# EAGLE design Atto_LED_Coaster_RevB (EAGLE 9.5.2)
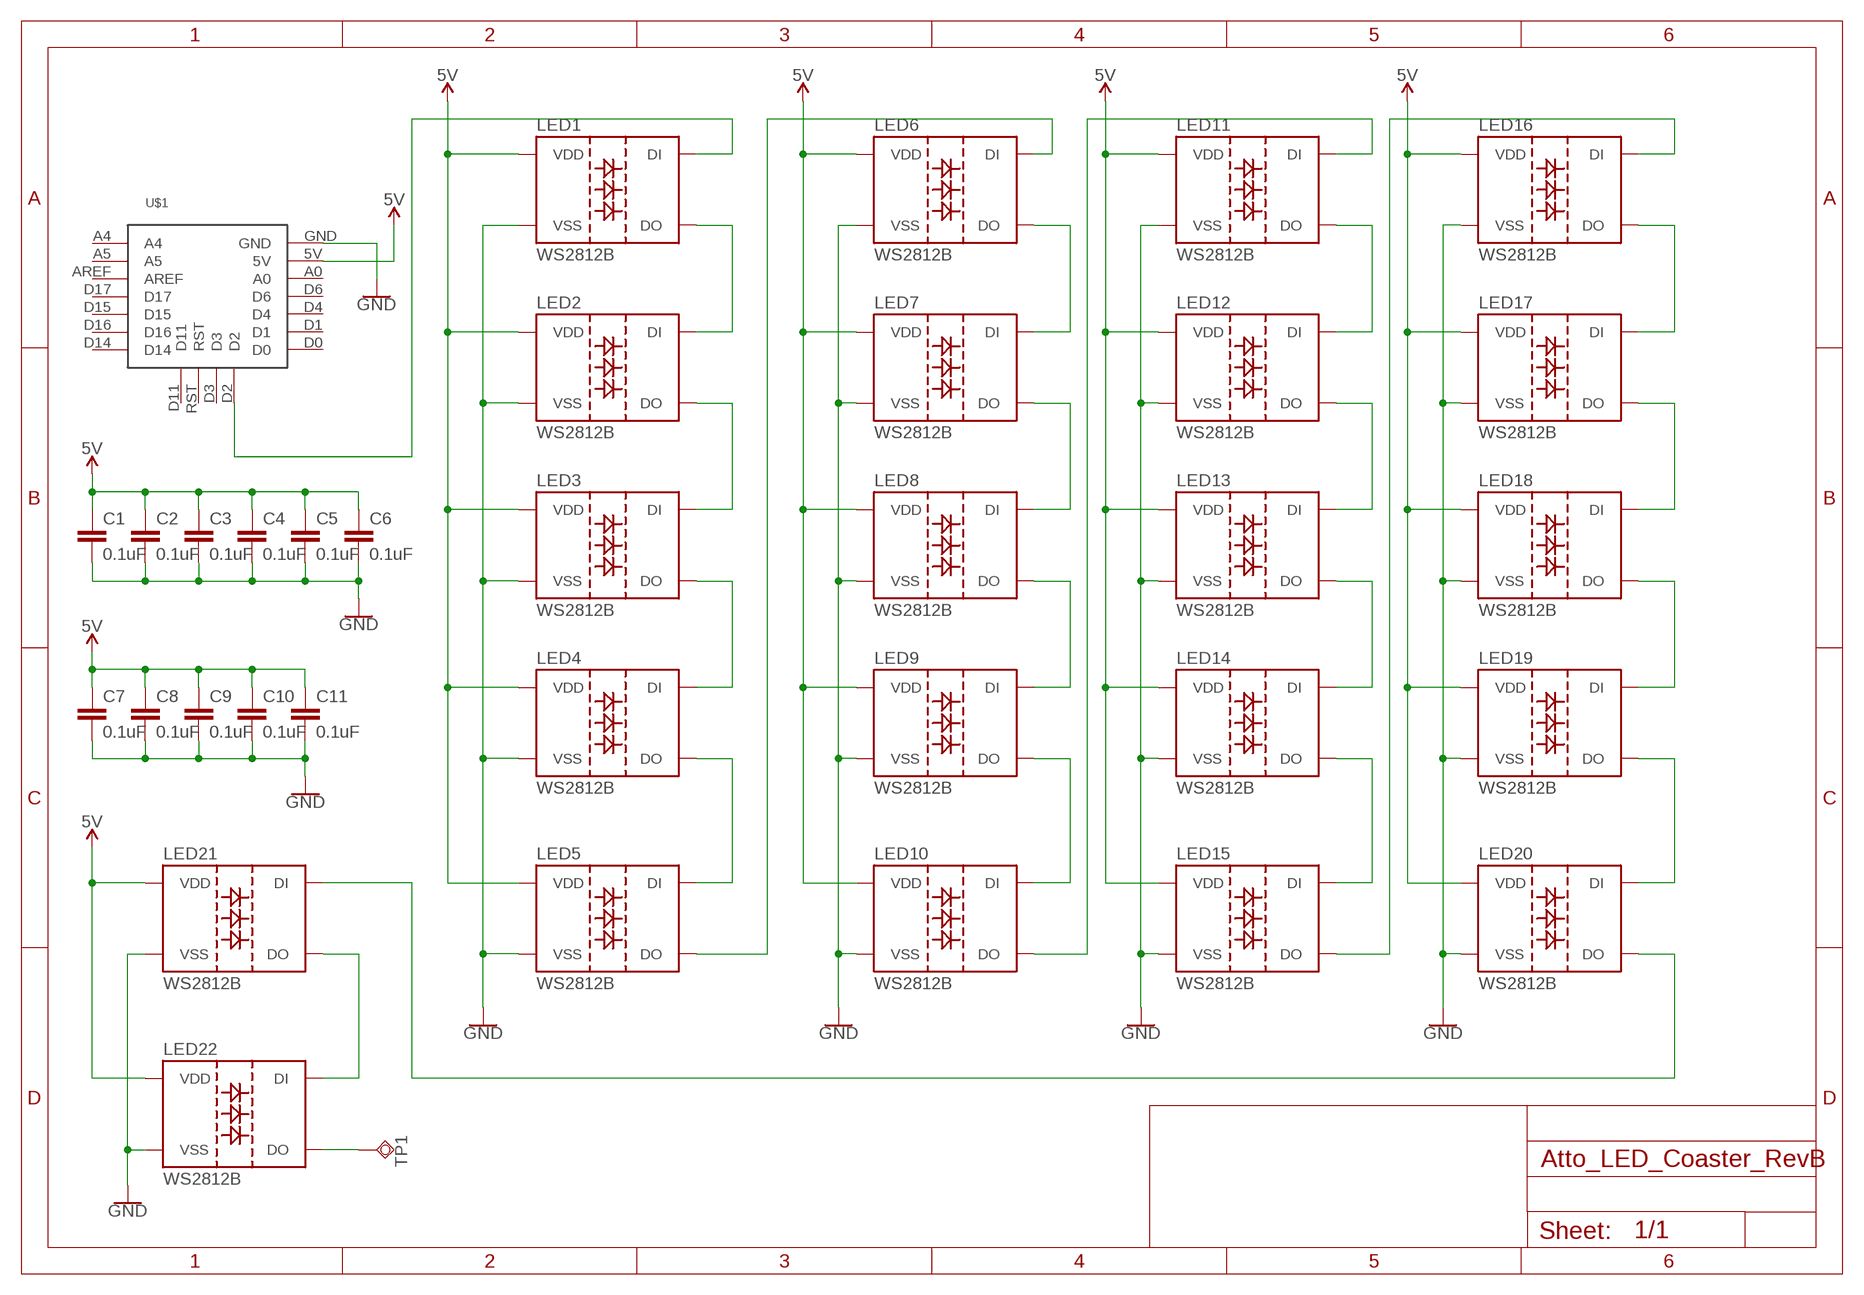
[diagram p0: schematic, sheet 1]

## Parts
C1  0.1uF  C-EUC0805  [C0805]
C2  0.1uF  C-EUC0805  [C0805]
C3  0.1uF  C-EUC0805  [C0805]
C4  0.1uF  C-EUC0805  [C0805]
C5  0.1uF  C-EUC0805  [C0805]
C6  0.1uF  C-EUC0805  [C0805]
C7  0.1uF  C-EUC0805  [C0805]
C8  0.1uF  C-EUC0805  [C0805]
C9  0.1uF  C-EUC0805  [C0805]
C10  0.1uF  C-EUC0805  [C0805]
C11  0.1uF  C-EUC0805  [C0805]
LED1  WS2812B  [WS2812B]
LED2  WS2812B  [WS2812B]
LED3  WS2812B  [WS2812B]
LED4  WS2812B  [WS2812B]
LED5  WS2812B  [WS2812B]
LED6  WS2812B  [WS2812B]
LED7  WS2812B  [WS2812B]
LED8  WS2812B  [WS2812B]
LED9  WS2812B  [WS2812B]
LED10  WS2812B  [WS2812B]
LED11  WS2812B  [WS2812B]
LED12  WS2812B  [WS2812B]
LED13  WS2812B  [WS2812B]
LED14  WS2812B  [WS2812B]
LED15  WS2812B  [WS2812B]
LED16  WS2812B  [WS2812B]
LED17  WS2812B  [WS2812B]
LED18  WS2812B  [WS2812B]
LED19  WS2812B  [WS2812B]
LED20  WS2812B  [WS2812B]
LED21  WS2812B  [WS2812B]
LED22  WS2812B  [WS2812B]
TP1  TPSQTP20R  [TP20R]
U$1  PIKSEY_ATTO  [PIKSEY_ATTO]

## Nets
5V: C1.1 C2.1 C3.1 C4.1 C5.1 C6.1 C7.1 C8.1 C9.1 C10.1 C11.1 LED1.3(VDD) LED2.3(VDD) LED3.3(VDD) LED4.3(VDD) LED5.3(VDD) LED6.3(VDD) LED7.3(VDD) LED8.3(VDD) LED9.3(VDD) LED10.3(VDD) LED11.3(VDD) LED12.3(VDD) LED13.3(VDD) LED14.3(VDD) LED15.3(VDD) LED16.3(VDD) LED17.3(VDD) LED18.3(VDD) LED19.3(VDD) LED20.3(VDD) LED21.3(VDD) LED22.3(VDD) U$1.5V
GND: C1.2 C2.2 C3.2 C4.2 C5.2 C6.2 C7.2 C8.2 C9.2 C10.2 C11.2 LED1.1(VSS) LED2.1(VSS) LED3.1(VSS) LED4.1(VSS) LED5.1(VSS) LED6.1(VSS) LED7.1(VSS) LED8.1(VSS) LED9.1(VSS) LED10.1(VSS) LED11.1(VSS) LED12.1(VSS) LED13.1(VSS) LED14.1(VSS) LED15.1(VSS) LED16.1(VSS) LED17.1(VSS) LED18.1(VSS) LED19.1(VSS) LED20.1(VSS) LED21.1(VSS) LED22.1(VSS) U$1.GND
N$1: LED1.2(DO) LED2.4(DI)
N$2: LED2.2(DO) LED3.4(DI)
N$3: LED3.2(DO) LED4.4(DI)
N$4: LED4.2(DO) LED5.4(DI)
N$5: LED6.2(DO) LED7.4(DI)
N$6: LED7.2(DO) LED8.4(DI)
N$7: LED8.2(DO) LED9.4(DI)
N$8: LED9.2(DO) LED10.4(DI)
N$9: LED11.2(DO) LED12.4(DI)
N$10: LED12.2(DO) LED13.4(DI)
N$11: LED13.2(DO) LED14.4(DI)
N$12: LED14.2(DO) LED15.4(DI)
N$13: LED16.2(DO) LED17.4(DI)
N$14: LED17.2(DO) LED18.4(DI)
N$15: LED18.2(DO) LED19.4(DI)
N$16: LED19.2(DO) LED20.4(DI)
N$17: LED22.2(DO) TP1.TP
N$18: LED15.2(DO) LED16.4(DI)
N$19: LED10.2(DO) LED11.4(DI)
N$20: LED5.2(DO) LED6.4(DI)
N$21: LED1.4(DI) U$1.D2
N$22: LED21.2(DO) LED22.4(DI)
N$23: LED20.2(DO) LED21.4(DI)
Unconnected: U$1.A0 U$1.A4 U$1.A5 U$1.AREF U$1.D0 U$1.D1 U$1.D3 U$1.D4 U$1.D6 U$1.D11 U$1.D14 U$1.D15 U$1.D16 U$1.D17 U$1.RST

## Library data of the parts
C1-C11 = rcl:C-EU: CAPACITOR, European symbol; SPICEPREFIX: C
LED1-LED10 LED12-LED22 = WS2812B-E:WS2812B
LED11 = WS2812B-E:WS2812B; SPICEPREFIX: E
TP1 = testpad:TPSQ: Test pad
U$1 = Frenoy_Custom:PIKSEY_ATTO

## Board
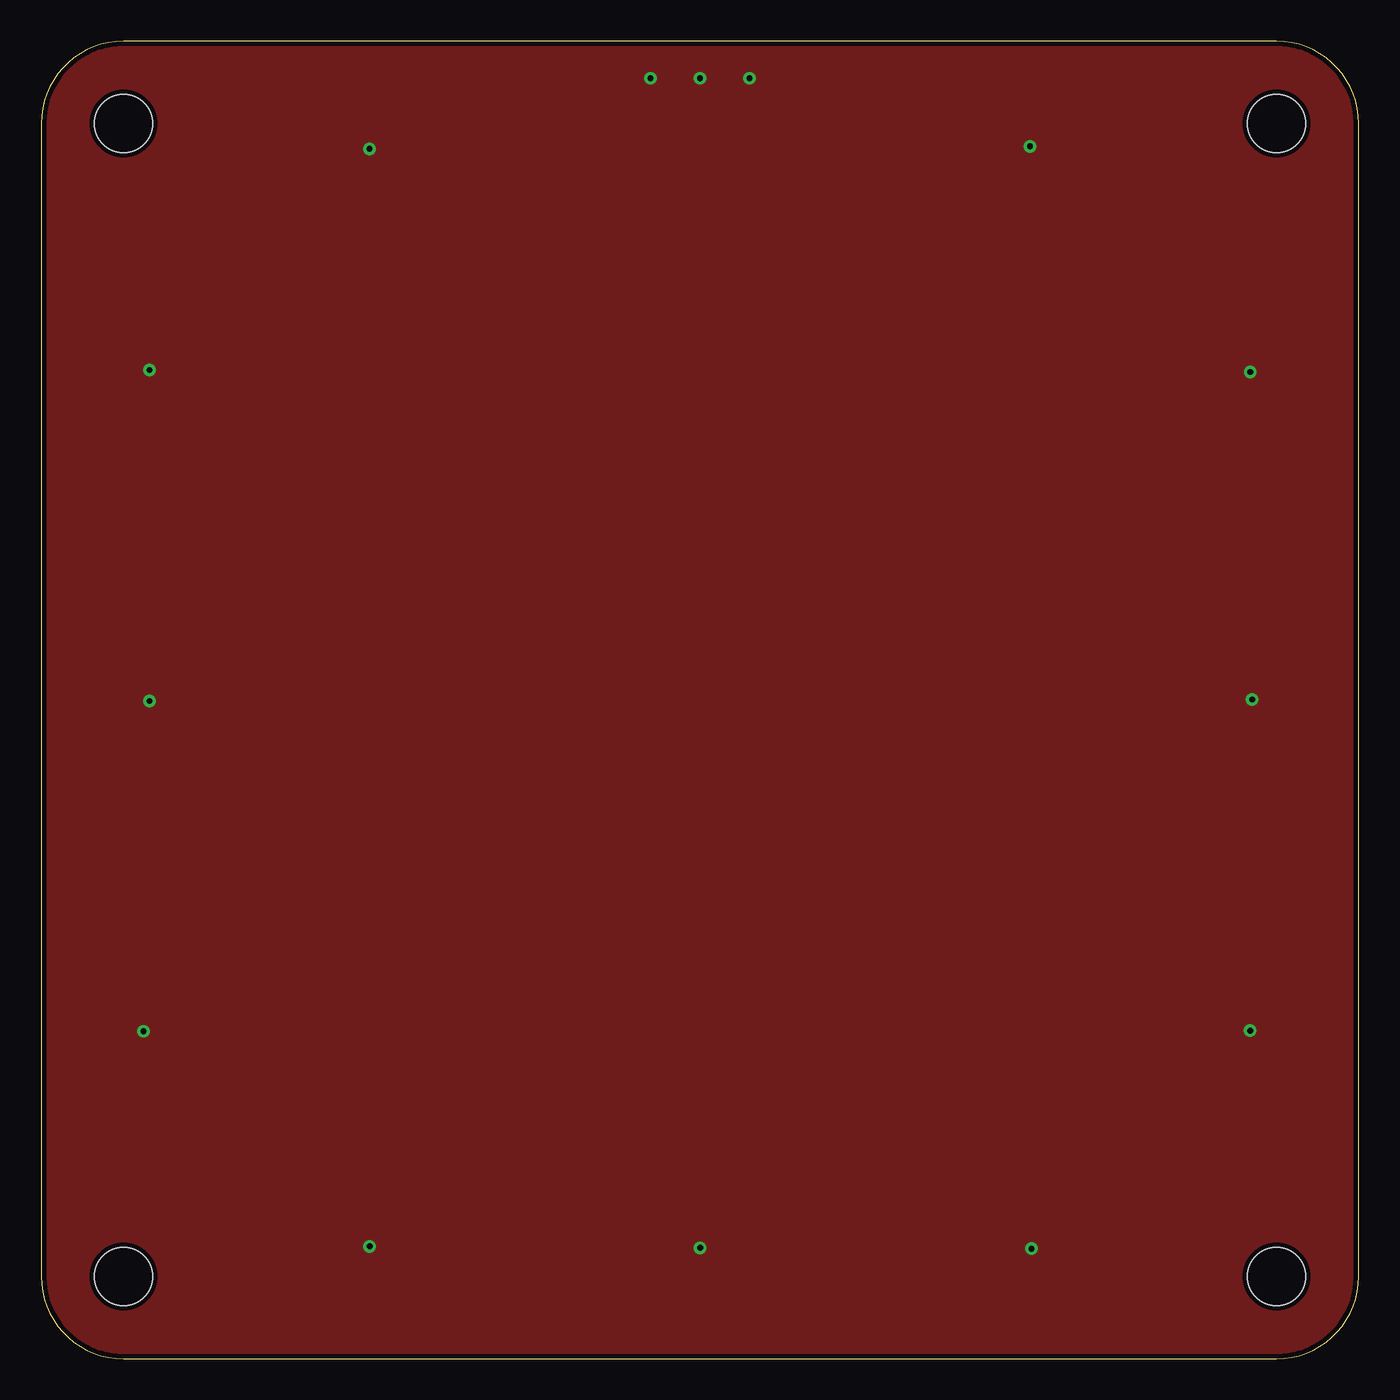
[diagram p1: board, top side]
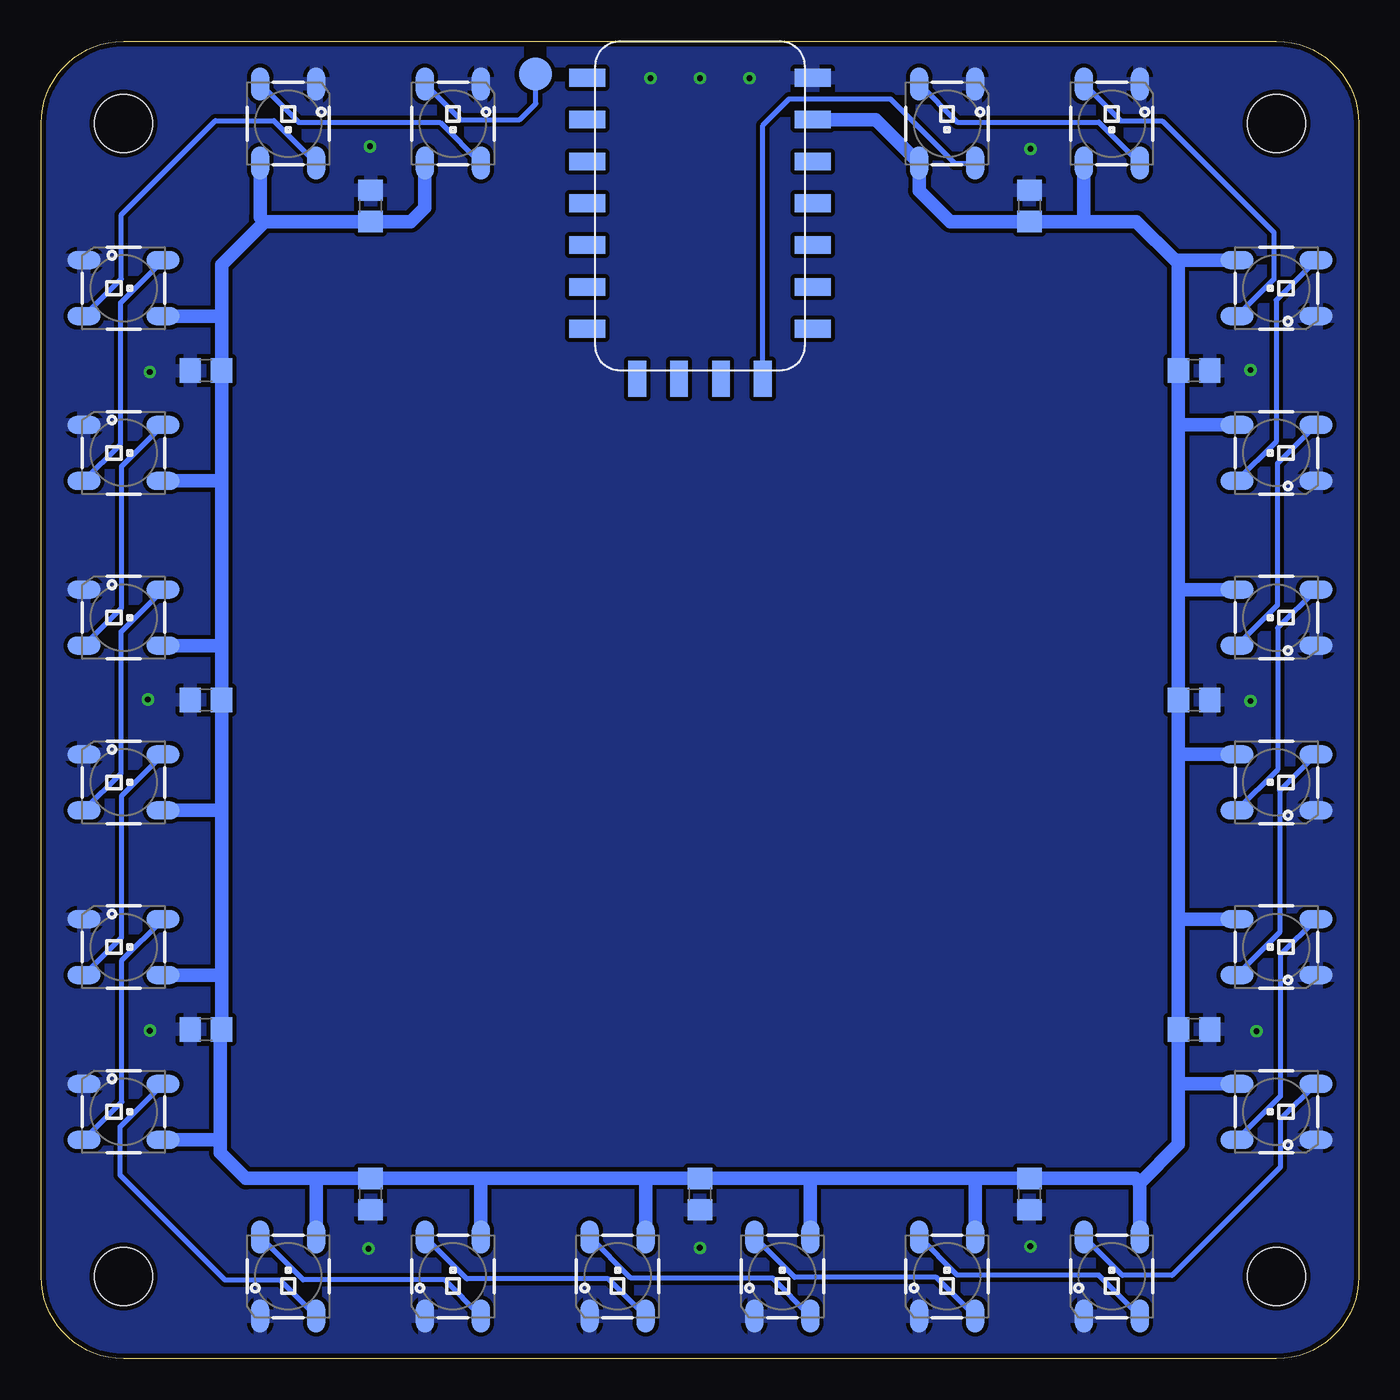
[diagram p2: board, bottom side, seen from below]

Size 80 x 80 mm. Coordinates in mm from the lower left corner, seen from the top.
Outline: 75,80 5,80 arc90 0,75 0,5 arc90 5,0 75,0 arc90 80,5 80,75 arc90 75,80
Copper layers (1*16): Top 0.035mm / dielectric 1.5mm / Bottom 0.035mm
Design rules "JLPCB_2L_Recommended_Use_this": minimum track width 8mil, minimum drill 0.3mm, track to track 8mil, track to pad 8mil, pad to pad 8mil, via to via 8mil, smd to smd 8mil, copper to edge 12mil, drill to drill 6mil, minimum pad ring 10mil, minimum via ring 8mil, stop-mask expansion 4mil, vias tented up to drill 20mil, thermal gap 10mil
Holes 3.5 mm at 5,75 75,75 75,5 5,5

### Footprints (pad centres in the part's own frame; a part is rotated, then mirrored left to right if it is on the bottom)
C0805 = smd 1.3 x 1.5: 1 -0.95,0; 2 0.95,0
WS2812B = smd 2 x 1.1: 1 -2.4,1.7; 2 -2.4,-1.7; 3 2.4,-1.7; 4 2.4,1.7
TP20R = smd 2 x 2: TP 0,0
PIKSEY_ATTO = smd 2.184 x 1.067: 5V 6.858,15.24; A0 6.858,12.7; A4 -6.858,15.24; A5 -6.858,17.78; AREF -6.858,12.7; D0 6.858,2.54; D1 6.858,5.08; D4 6.858,7.62; D6 6.858,10.16; D14 -6.858,2.54; D15 -6.858,7.62; D16 -6.858,5.08; D17 -6.858,10.16; GND 6.858,17.78 | smd 1.067 x 2.184: D2 3.81,-0.508; D3 1.27,-0.508; D11 -3.81,-0.508; RST -1.27,-0.508

### Placement (x,y rotation side)
C1  20,70 90 bottom
C2  10,60 0 bottom
C3  10,40 0 bottom
C4  10,20 0 bottom
C5  20,10 270 bottom
C6  40,10 270 bottom
C7  60,10 270 bottom
C8  70,20 180 bottom
C9  70,40 180 bottom
C10  70,60 180 bottom
C11  60,70 90 bottom
LED1  25,75 270 bottom
LED2  15,75 270 bottom
LED3  5,65 180 bottom
LED4  5,55 180 bottom
LED5  5,45 180 bottom
LED6  5,35 180 bottom
LED7  5,25 180 bottom
LED8  5,15 180 bottom
LED9  15,5 90 bottom
LED10  25,5 90 bottom
LED11  35,5 90 bottom
LED12  45,5 90 bottom
LED13  55,5 90 bottom
LED14  65,5 90 bottom
LED15  75,15 0 bottom
LED16  75,25 0 bottom
LED17  75,35 0 bottom
LED18  75,45 0 bottom
LED19  75,55 0 bottom
LED20  75,65 0 bottom
LED21  65,75 270 bottom
LED22  55,75 270 bottom
TP1  50,78 0 bottom
U$1  40,60 0 bottom

### Tracks (layer width: path | path; a pad name or v marks a point on that pad's centre or on a via)
5V
  Bottom 0.813: U$1.5V 29.34,75.24 LED1.3 26.7,70.93 24.82,69.05 C1.1 16.62,69.05 | 16.68,72.58 LED2.3 16.7,69.12 16.62,69.05 | LED3.3 11.15,66.7 | 16.62,69.05 13.5,69.05 11.15,66.7 | 23.38,10.95 C5.1 13.58,10.95 13.3,10.67 | 23.38,10.95 33.26,10.95 | 33.26,10.95 C6.1 43.39,10.95 | 43.39,10.95 53.42,10.95 | 53.42,10.95 C7.1 63.32,10.95 | LED9.3 13.3,10.67 | LED10.3 23.3,10.87 23.38,10.95 | LED11.3 33.3,10.91 33.26,10.95 | LED12.3 43.3,10.86 43.39,10.95 | LED13.3 53.3,10.83 53.42,10.95 | 63.32,10.95 67.58,10.95 69.13,12.5 69.13,13.27 | 69.13,13.27 69.13,19.92 C8.1 69.05,23.38 | 69.05,23.38 69.05,33.25 | 69.05,33.25 C9.1 69.05,43.35 | 69.05,43.35 69.05,53.29 | 69.05,53.29 C10.1 69.05,63.27 | 69.05,63.27 69.05,66.43 66.43,69.05 | 66.43,69.05 C11.1 57.55,69.05 56.7,69.9 LED22.3 | LED21.3 66.7,69.32 66.43,69.05 | 72.49,63.19 LED20.3 69.08,63.3 69.05,63.27 | LED19.3 69.06,53.3 69.05,53.29 | LED18.3 69.1,43.3 69.05,43.35 | LED17.3 69.1,33.3 69.05,33.25 | LED16.3 69.13,23.3 69.05,23.38 | LED15.3 69.17,13.3 69.13,13.27 | LED14.3 63.3,10.93 63.32,10.95 | 11.15,60.2 C2.1 | C2.1 10.95,56.66 | 10.95,56.66 10.95,46.59 | 10.95,46.59 C3.1 10.95,36.64 | 10.95,36.64 10.95,26.63 | 10.95,26.63 C4.1 10.95,16.56 | 10.95,16.56 10.95,13.02 13.3,10.67 | C2.1 10.95,66.5 11.15,66.7 | LED4.3 10.9,56.7 10.95,56.66 | LED5.3 10.84,46.7 10.95,46.59 | LED6.3 10.89,36.7 10.95,36.64 | LED7.3 10.88,26.7 10.95,26.63 | LED8.3 10.81,16.7 10.95,16.56
GND  (via drill 0.35)
  other vias: 37,77.75 40,77.75 43,77.75 19.93,73.46 6.58,60.03 6.58,39.94 6.22,19.89 19.94,6.83 40.01,6.74 60.12,6.69 73.4,19.92 73.52,40.03 73.41,59.92 60.03,73.61
  pour Bottom (isolate 0.254): -0.77,80.45 80.37,80.45 80.37,-0.78 -0.8,-0.78 -0.8,80.45
  pour Top (isolate 0.254): -0.33,80.36 80.82,80.36 80.82,-0.87 -0.35,-0.87 -0.35,80.36
N$1
  Bottom 0.305: LED1.2 24.39,75.08 15.79,75.08 LED2.4
N$2
  Bottom 0.305: LED2.2 14.47,75.17 11.94,75.17 5.16,68.39 5.16,65.54 LED3.4
N$3
  Bottom 0.305: LED3.2 5.02,64.28 5.02,55.68 LED4.4
N$4
  Bottom 0.305: LED4.2 4.95,54.35 4.95,45.75 LED5.4
N$5
  Bottom 0.305: LED6.2 4.81,34.49 4.81,25.89 LED7.4
N$6
  Bottom 0.305: LED7.2 4.76,24.54 4.76,15.94 LED8.4
N$7
  Bottom 0.305: LED8.2 4.76,14.54 4.76,11.64 11.34,5.06 14.36,5.06 LED9.4
N$8
  Bottom 0.305: LED9.2 15.79,5.08 24.39,5.08 LED10.4
N$9
  Bottom 0.305: LED11.2 35.59,4.89 44.19,4.89 LED12.4
N$10
  Bottom 0.305: LED12.2 45.56,4.86 54.16,4.86 LED13.4
N$11
  Bottom 0.305: LED13.2 55.49,4.79 64.09,4.79 LED14.4
N$12
  Bottom 0.305: LED14.2 65.48,4.78 68.83,4.78 75.21,11.16 75.21,14.09 LED15.4
N$13
  Bottom 0.305: LED16.2 75.11,25.59 75.11,34.19 LED17.4
N$14
  Bottom 0.305: LED17.2 75.15,35.55 75.15,44.15 LED18.4
N$15
  Bottom 0.305: LED18.2 75.11,45.59 75.11,54.19 LED19.4
N$16
  Bottom 0.305: LED19.2 75.17,55.53 75.17,64.13 LED20.4
N$17
  Bottom 0.305: LED22.2 54.53,75.23 50.95,75.23 49.97,76.21 49.97,77.97 TP1.TP
N$18
  Bottom 0.305: LED15.2 75.1,15.6 75.1,24.2 LED16.4
N$19
  Bottom 0.305: LED10.2 25.65,4.95 34.25,4.95 LED11.4
N$20
  Bottom 0.305: LED5.2 4.93,44.37 4.93,35.77 LED6.4
N$21
  Bottom 0.305: U$1.D2 36.19,74.89 34.59,76.49 28.44,76.49 24.54,72.59 23.31,72.59 LED1.4
N$22
  Bottom 0.305: LED21.2 64.37,75.07 55.77,75.07 LED22.4
N$23
  Bottom 0.305: LED20.2 75.13,65.57 75.13,69.47 69.42,75.17 65.87,75.17 LED21.4